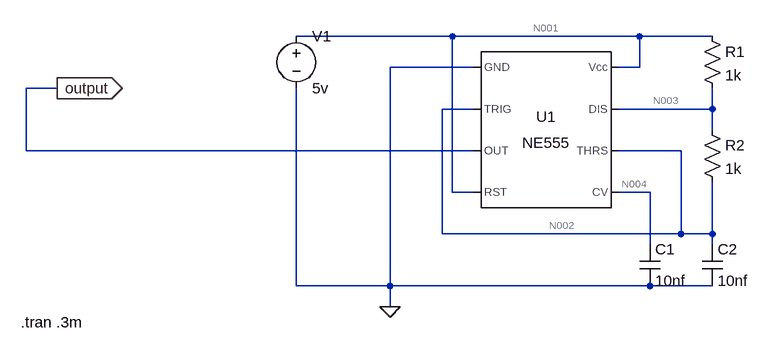
[diagram p0: schematic part1.2.asc]
part1.2.asc, the LTspice schematic file:
Version 4
SHEET 1 880 680
WIRE 64 16 -176 16
WIRE 352 16 64 16
WIRE 464 16 352 16
WIRE 96 64 -32 64
WIRE 352 64 352 16
WIRE 352 64 320 64
WIRE -544 96 -592 96
WIRE 96 128 48 128
WIRE 464 128 464 96
WIRE 464 128 320 128
WIRE 464 160 464 128
WIRE -592 192 -592 96
WIRE 96 192 -592 192
WIRE 416 192 320 192
WIRE 64 256 64 16
WIRE 96 256 64 256
WIRE 368 256 320 256
WIRE 48 320 48 128
WIRE 416 320 416 192
WIRE 416 320 48 320
WIRE 464 320 464 240
WIRE 464 320 416 320
WIRE 368 336 368 256
WIRE 464 336 464 320
WIRE -176 400 -176 96
WIRE -32 400 -32 64
WIRE -32 400 -176 400
WIRE 368 400 -32 400
WIRE 464 400 368 400
WIRE -32 432 -32 400
FLAG -32 432 0
FLAG -544 96 output
IOPIN -544 96 Out
SYMBOL Misc\\NE555 208 160 R0
SYMATTR InstName U1
SYMBOL cap 352 336 R0
SYMATTR InstName C1
SYMATTR Value 10nf
SYMBOL cap 448 336 R0
SYMATTR InstName C2
SYMATTR Value 10nf
SYMBOL res 448 0 R0
SYMATTR InstName R1
SYMATTR Value 1k
SYMBOL res 448 144 R0
SYMATTR InstName R2
SYMATTR Value 1k
SYMBOL voltage -176 0 R0
WINDOW 123 0 0 Left 0
WINDOW 39 0 0 Left 0
SYMATTR InstName V1
SYMATTR Value 5v
TEXT -600 456 Left 2 !.tran .3m

The netlist it stands for:
* part1.2.asc
XU1 0 N002 output N001 N004 N002 N003 N001 NE555  ; pins GND TRIG OUT RST CV THRS DIS Vcc
C1 N004 0 10nf
C2 N002 0 10nf
R1 N001 N003 1k
R2 N003 N002 1k
V1 N001 0 5v
.tran .3m
.lib NE555.sub
.backanno
.end

* Results of the author's LTspice run, read from the files saved beside the schematic
* Operating Point, zero values left out:
*   V(n002) = 5 V
*   V(n004) = 3.333 V
*   V(n001) = 5 V
*   V(n003) = 5 V
*   V(output) = 5 V
*   I(R2) = 10 nA
*   I(R1) = 16.67 nA
*   I(V1) = -1.611 mA
*   Ix(u1:1) = -1.611 mA
*   Ix(u1:2) = 5 nA
*   Ix(u1:4) = 22.67 µA
*   Ix(u1:6) = 5 nA
*   Ix(u1:7) = 6.672 nA
*   Ix(u1:8) = 1.588 mA
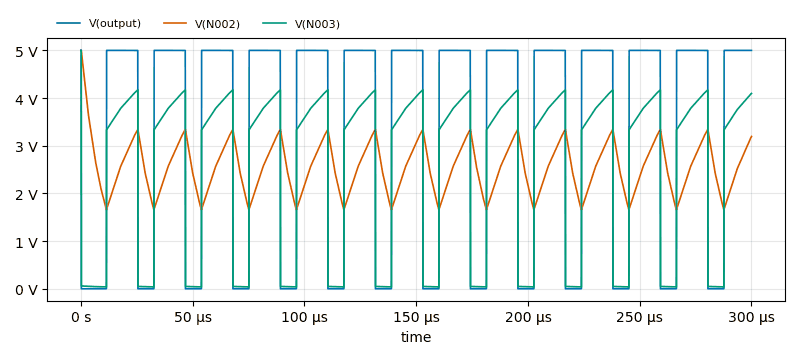
[diagram p1: Transient Analysis of part1.2.asc, plotted from the saved traces]
* Transient Analysis, 1 run:
*   V(output): min 30 µV, max 5 V, average 3.24 V, rms 4.023 V, last 5 V
*   V(N002): min 1.655 V, max 5 V, average 2.545 V, rms 2.617 V, last 3.194 V
*   V(N003): min 39.48 mV, max 5 V, average 2.485 V, rms 3.066 V, last 4.097 V